# EasyEDA schematic SCH_MKA-Lite-Pi-Interface.json

## Sheets
1 Power and Connectors: TITLE: MKA Lite Power and Connectors; REV: 1.0; Date: 2024-09-11; Sheet: 1/1; Drawn By: A. Franits, T. Salmon; Company: AidF Electronics
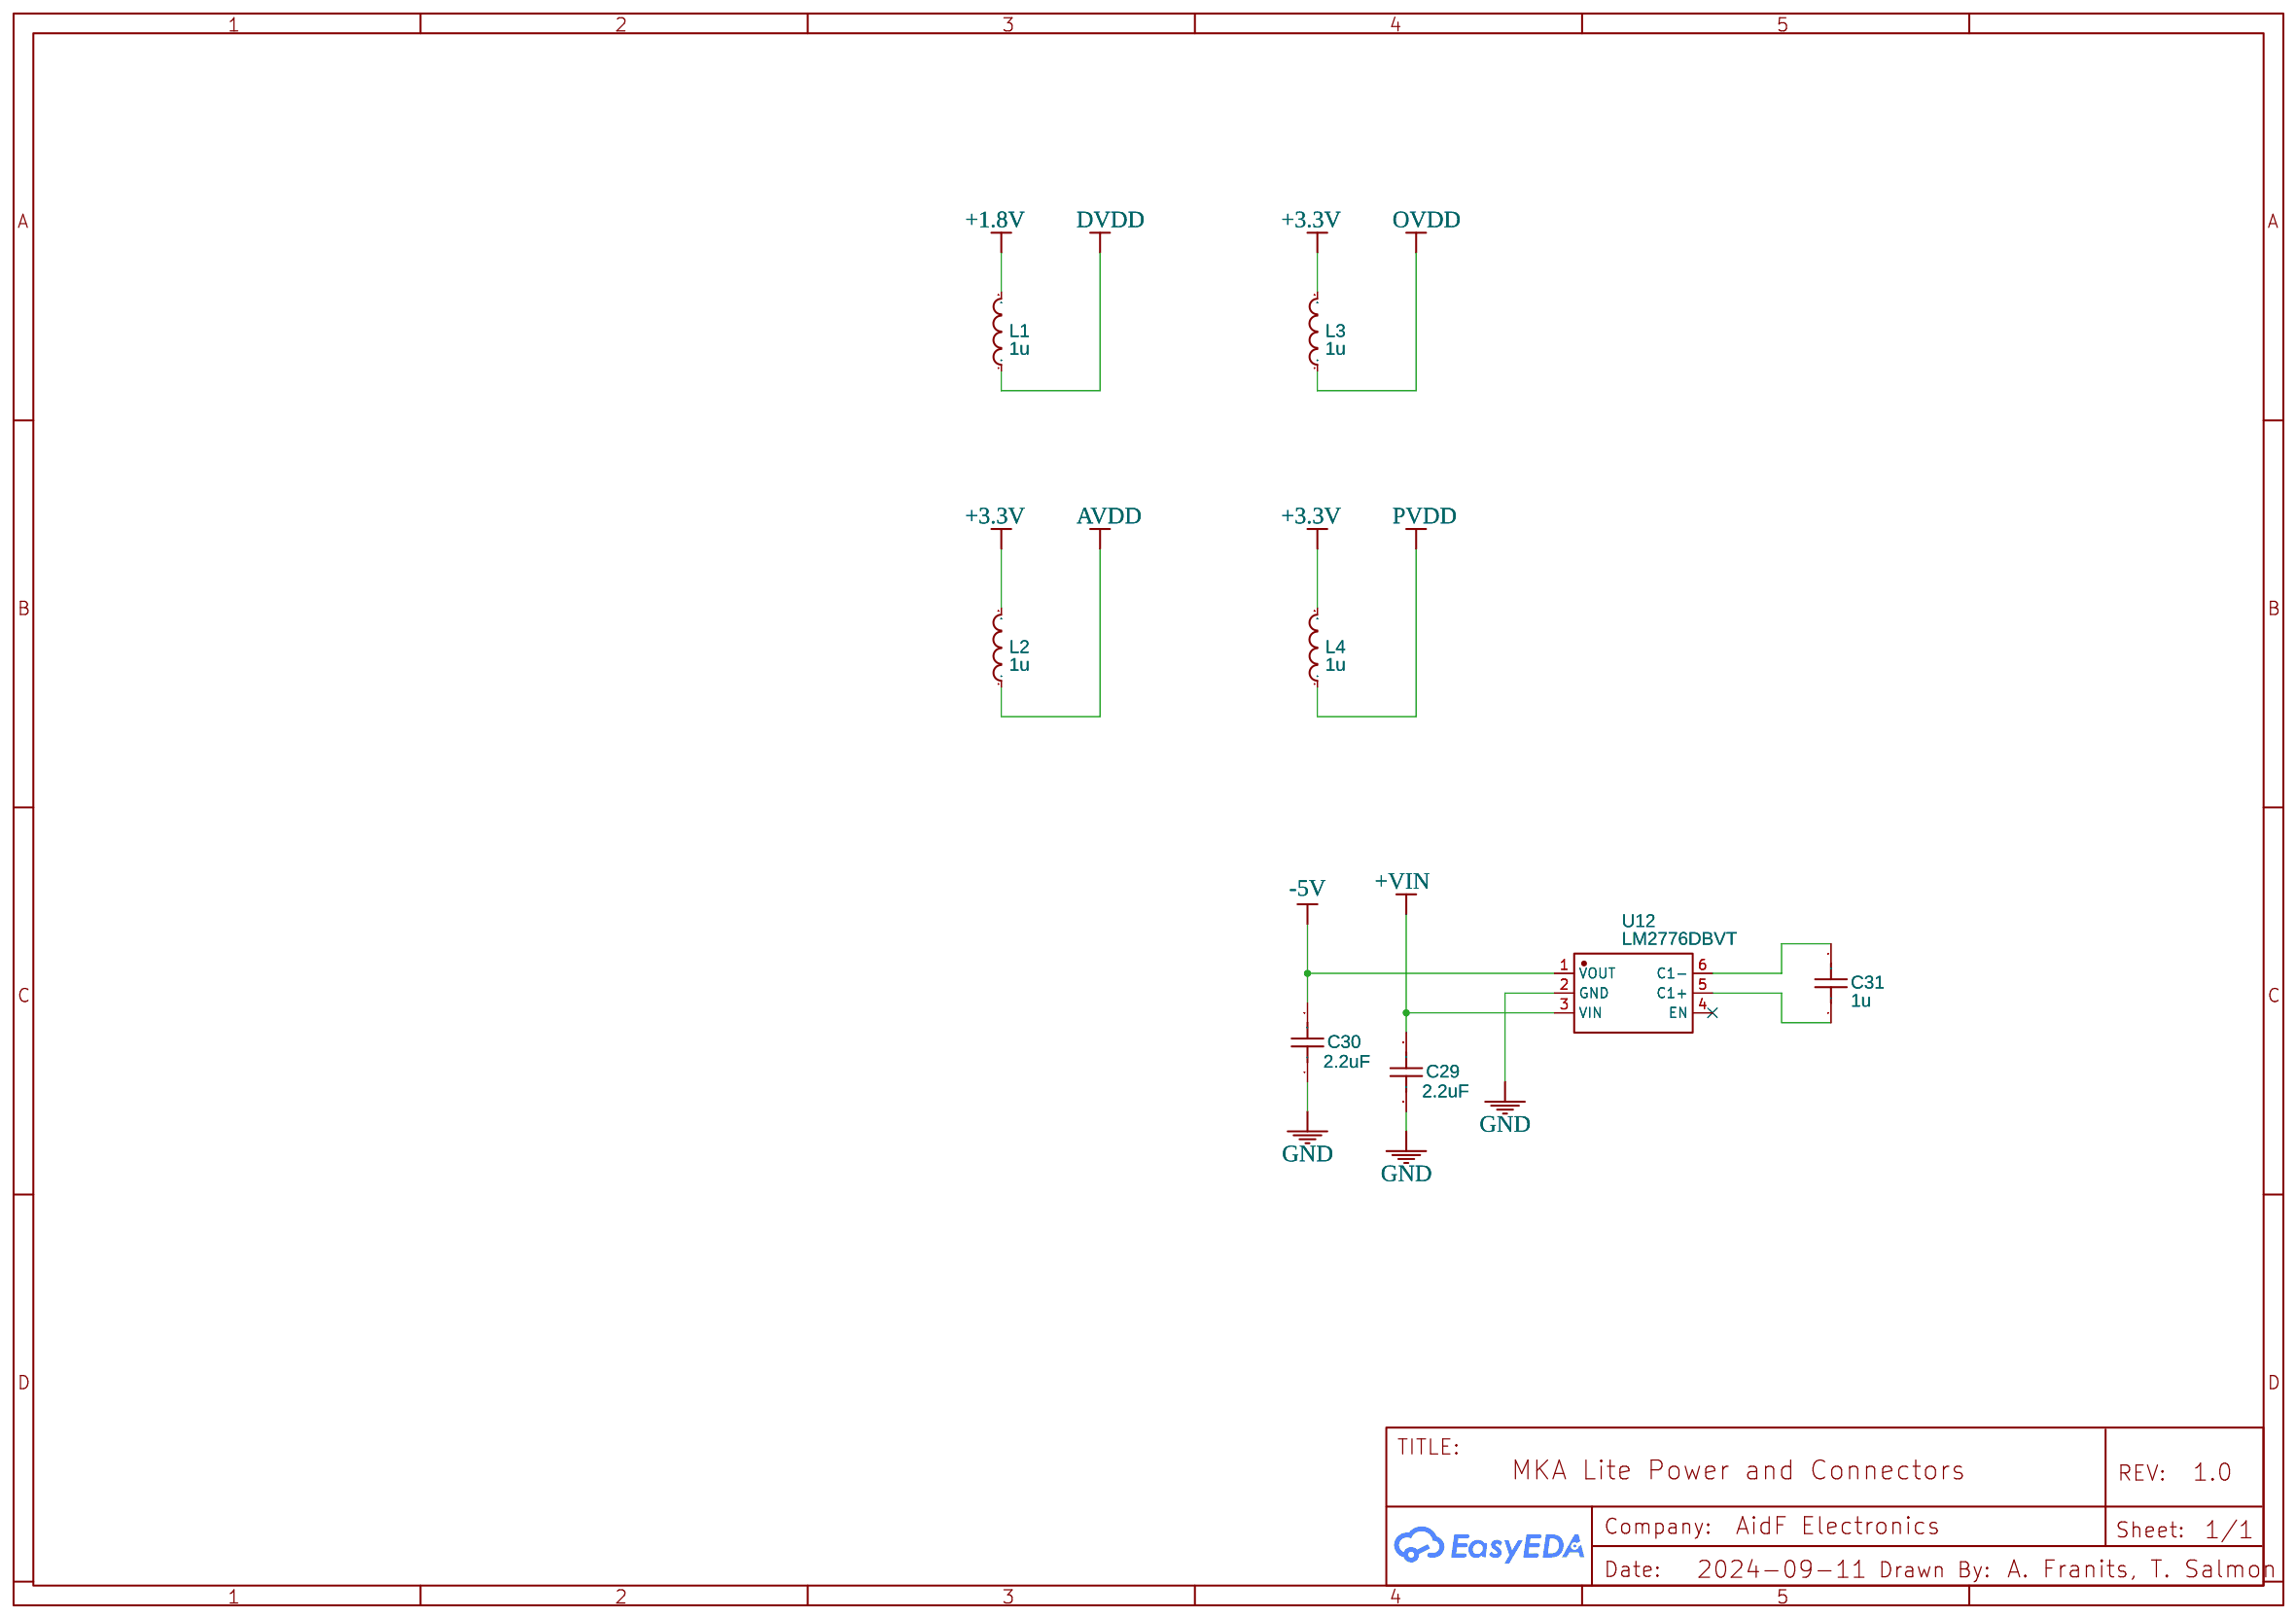
[diagram p0: Power and Connectors]
2 Raspberry Pi CM4 Interface: TITLE: MKA Lite Raspberry Pi Interface
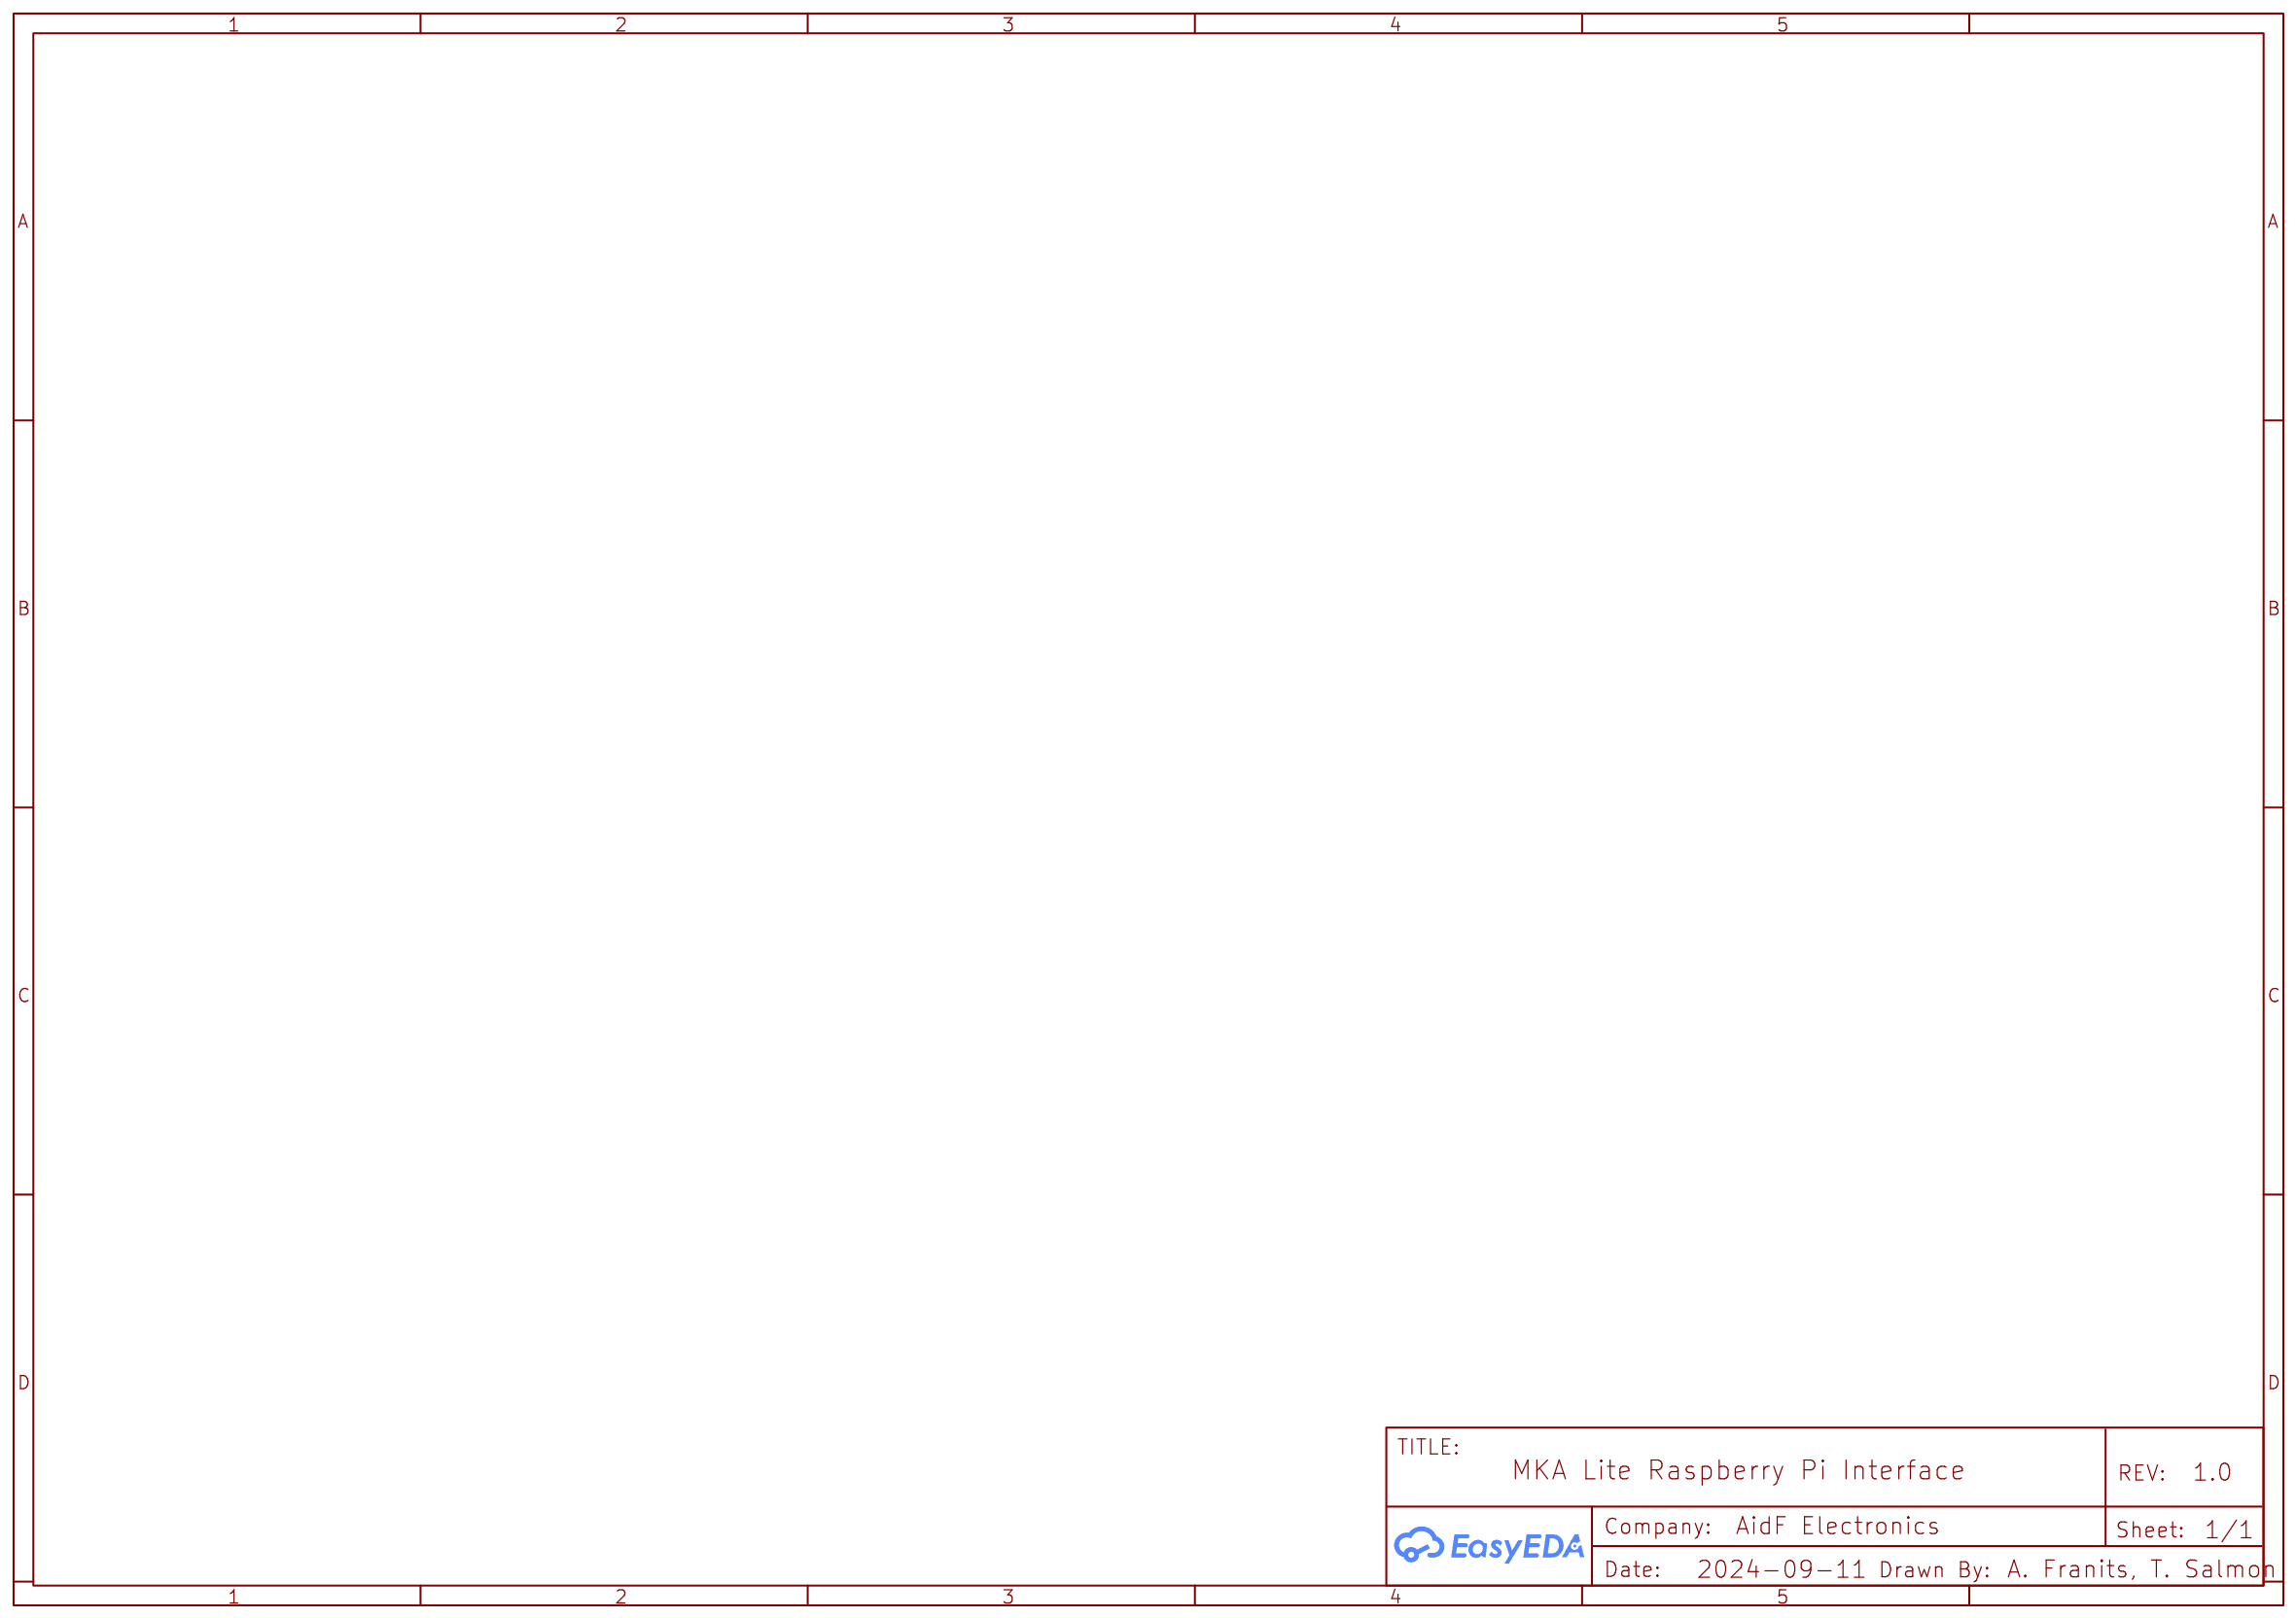
[diagram p1: Raspberry Pi CM4 Interface]
3 HDMI Inlet: TITLE: MKA Lite HDMI Conversion
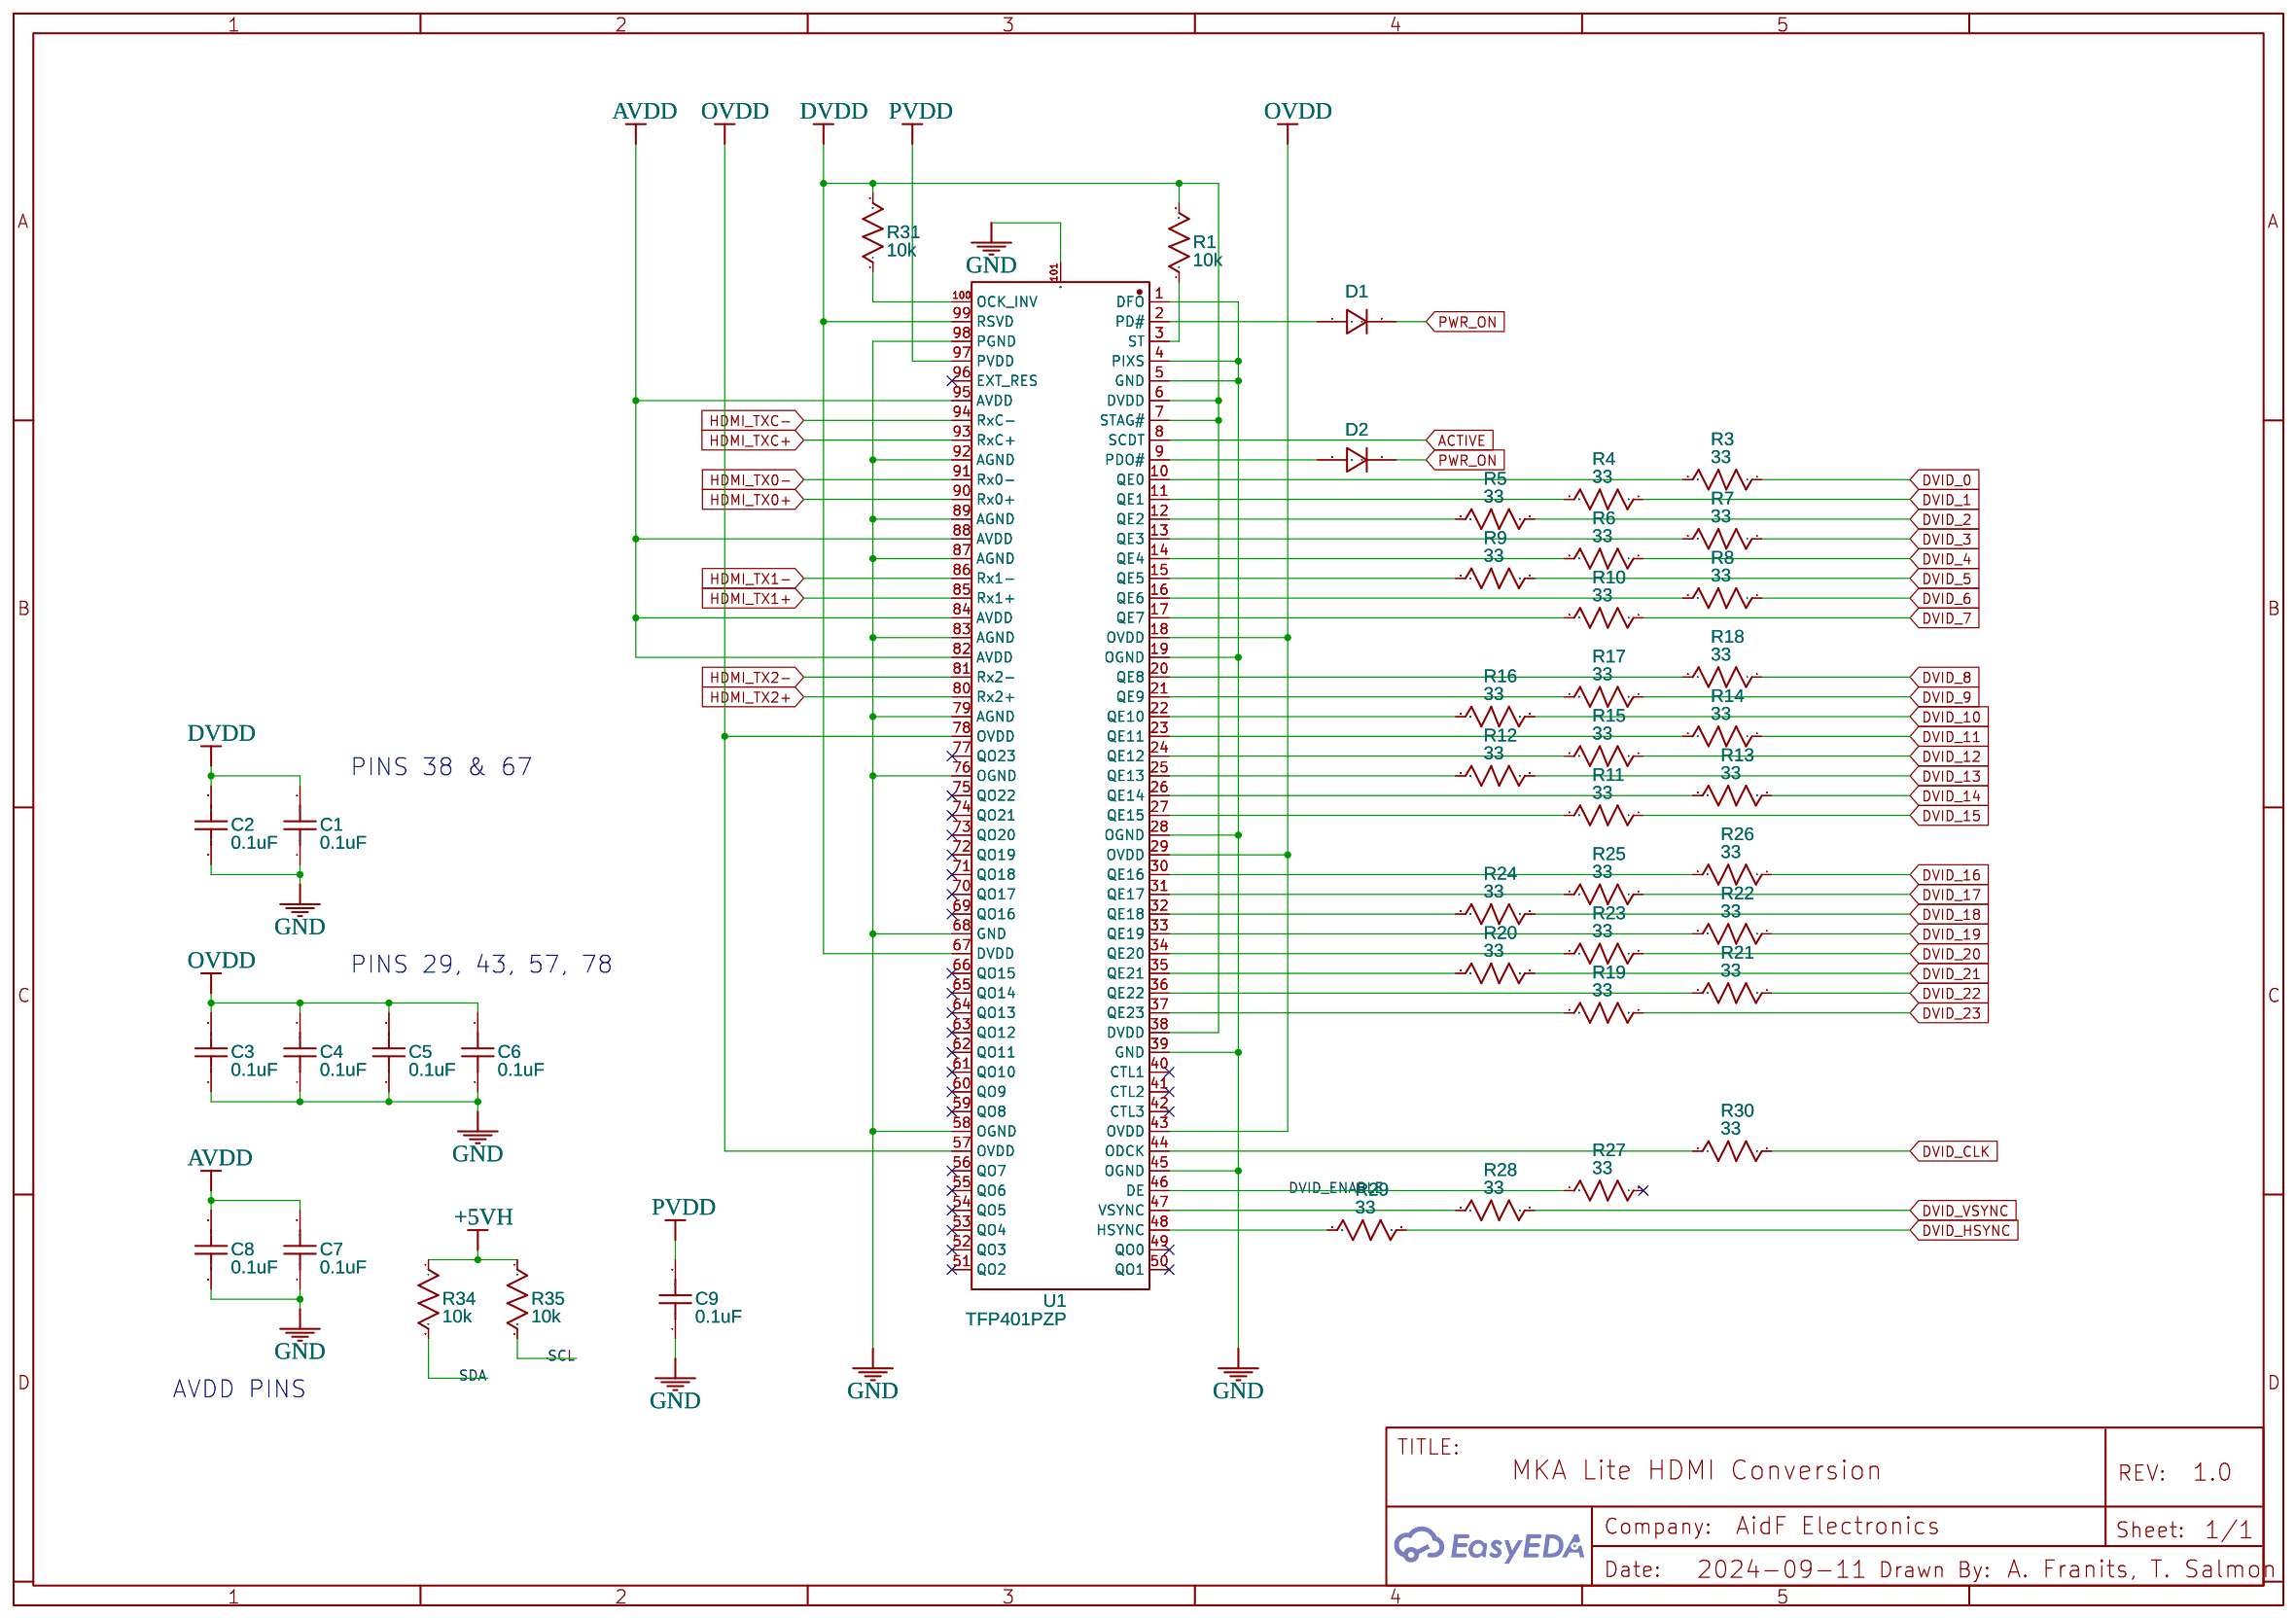
[diagram p2: HDMI Inlet]
4 RGB Outlet: TITLE: MKA Lite RGB Outlet
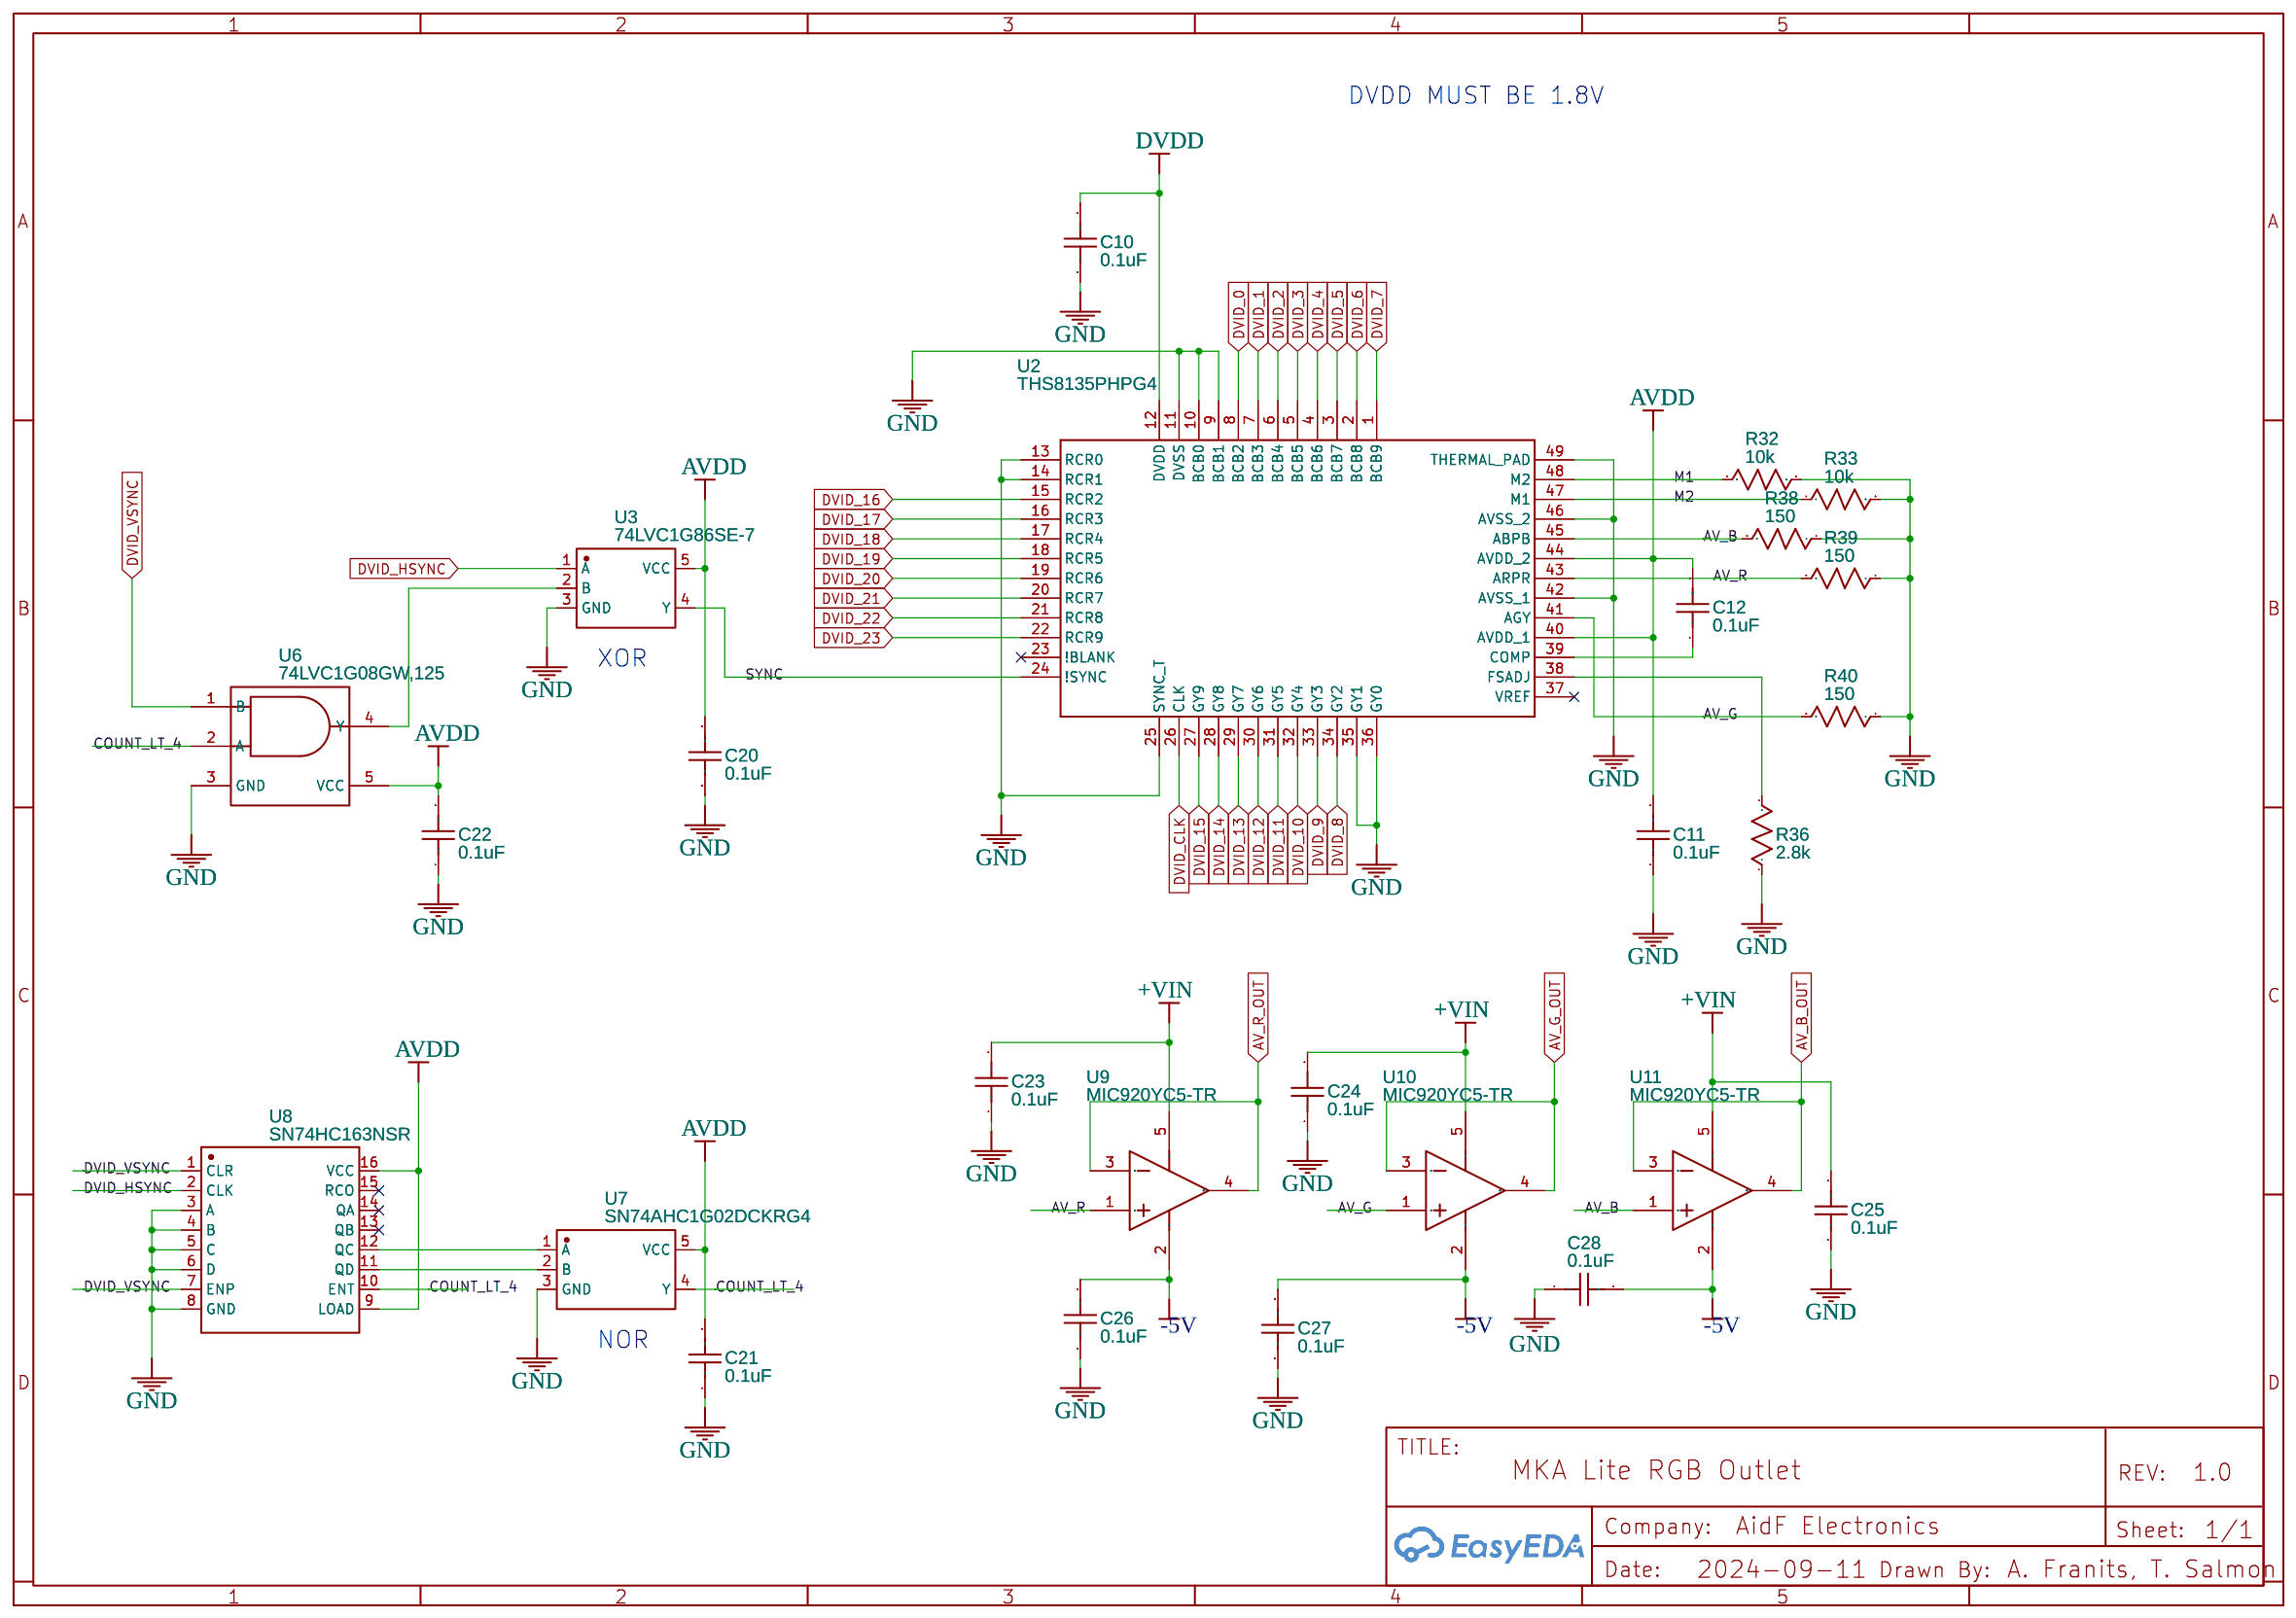
[diagram p3: RGB Outlet]
5 Audio Processing: TITLE: MKA Lite Audio Processing; Drawn By: Ted Salmon
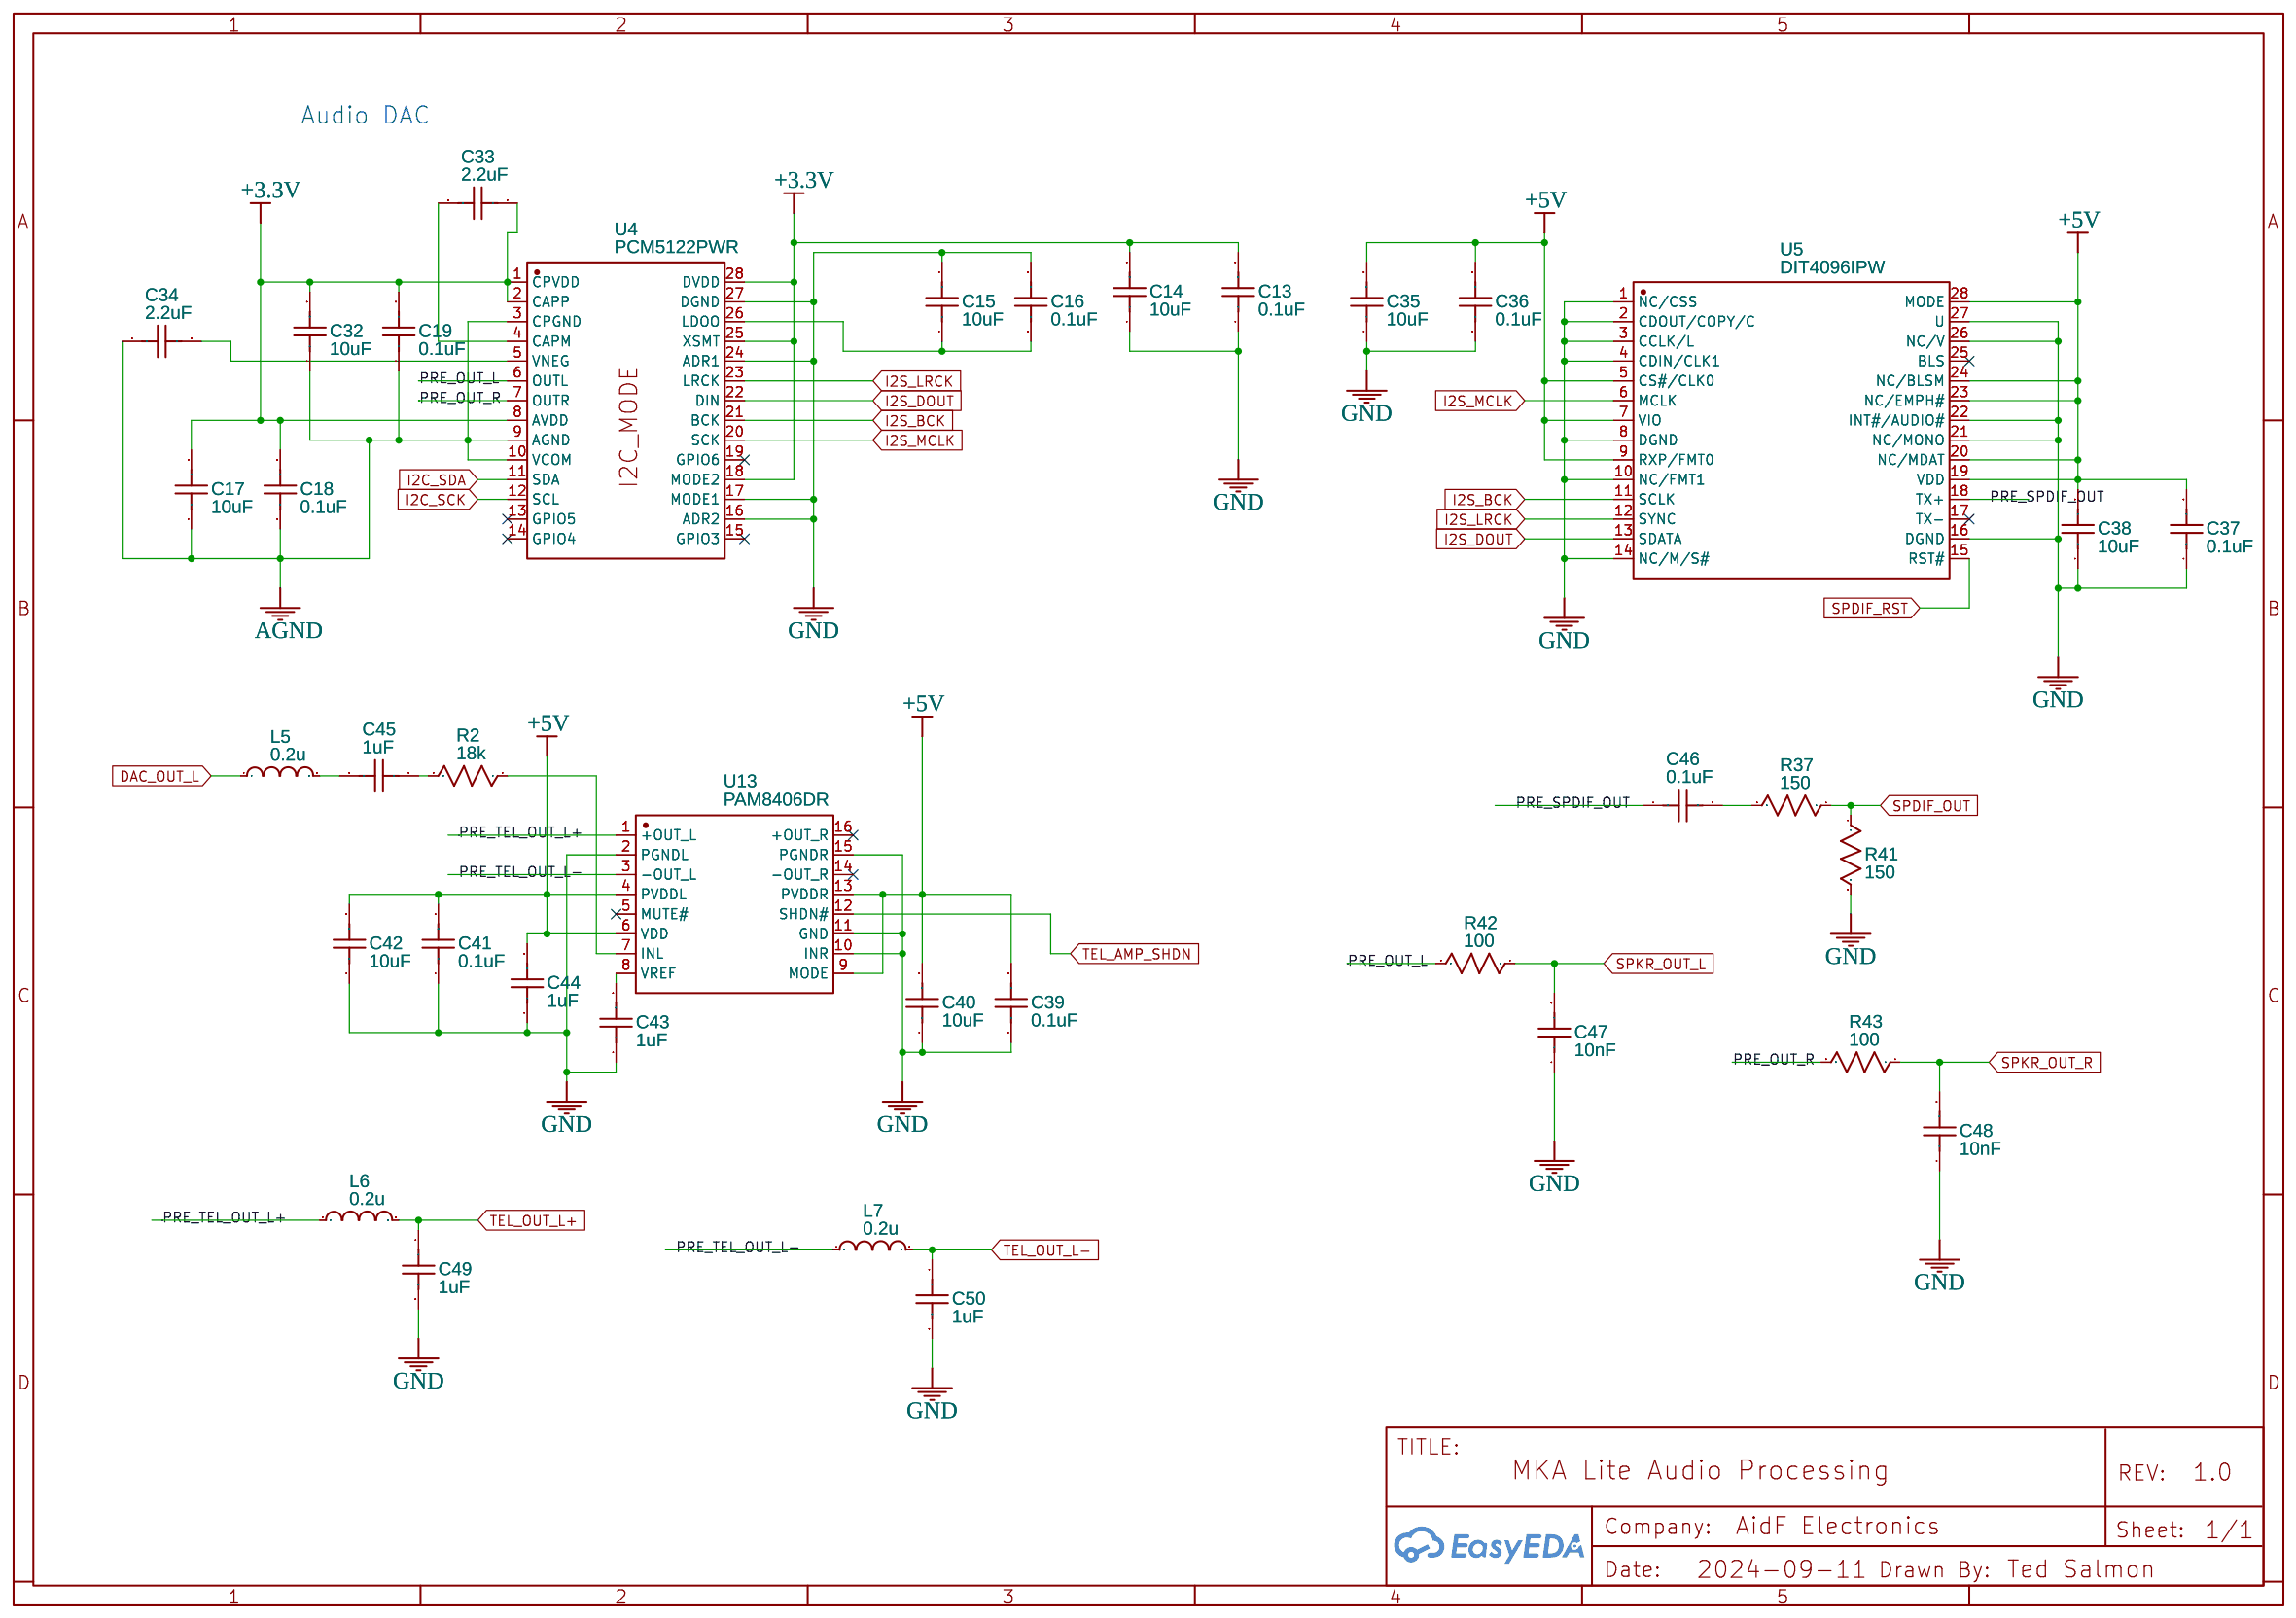
[diagram p4: Audio Processing]

## Parts
sheet Audio Processing
C13  0.1uF  [C0603]
C14  10uF  [C0603]
C15  10uF  [C0603]
C16  0.1uF  [C0603]
C17  10uF  [C0603]
C18  0.1uF  [C0603]
C19  0.1uF  [C0603]
C32  10uF  [C0603]
C33  2.2uF  [C0603]
C34  2.2uF  [C0603]
C35  10uF  [C0603]
C36  0.1uF  [C0603]
C37  0.1uF  [C0603]
C38  10uF  [C0603]
C39  0.1uF  [C0603]
C40  10uF  [C0603]
C41  0.1uF  [C0603]
C42  10uF  [C0603]
C43  1uF  [C0603]
C44  1uF  [C0603]
C45  1uF  [C0603]
C46  0.1uF  [C0603]
C47  10nF  [C0603]
C48  10nF  [C0603]
C49  1uF  [C0603]
C50  1uF  [C0603]
L5  0.2u  [L0603]
L6  0.2u  [L0603]
L7  0.2u  [L0603]
R2  18k  [R0603]
R37  150  [R0603]
R41  150  [R0603]
R42  100  [R0603]
R43  100  [R0603]
U4  PCM5122PWR  [TSSOP-28_L9.8-W6.6-P0.65-BL]
U5  DIT4096IPW  [TSSOP-28_L9.7-W4.4-P0.65-LS6.4-BL]
U13  PAM8406DR  [SOIC-16_L9.9-W3.9-P1.27-LS6.0-BL]
sheet HDMI Inlet
C1  0.1uF  [C0603]
C2  0.1uF  [C0603]
C3  0.1uF  [C0603]
C4  0.1uF  [C0603]
C5  0.1uF  [C0603]
C6  0.1uF  [C0603]
C7  0.1uF  [C0603]
C8  0.1uF  [C0603]
C9  0.1uF  [C0603]
D1  SD103AWS-TP  [SOD-323_L1.8-W1.3-LS2.6-FD]
D2  SD103AWS-TP  [SOD-323_L1.8-W1.3-LS2.6-FD]
R1  10k  [R0603]
R3  33  [R0603]
R4  33  [R0603]
R5  33  [R0603]
R6  33  [R0603]
R7  33  [R0603]
R8  33  [R0603]
R9  33  [R0603]
R10  33  [R0603]
R11  33  [R0603]
R12  33  [R0603]
R13  33  [R0603]
R14  33  [R0603]
R15  33  [R0603]
R16  33  [R0603]
R17  33  [R0603]
R18  33  [R0603]
R19  33  [R0603]
R20  33  [R0603]
R21  33  [R0603]
R22  33  [R0603]
R23  33  [R0603]
R24  33  [R0603]
R25  33  [R0603]
R26  33  [R0603]
R27  33  [R0603]
R28  33  [R0603]
R29  33  [R0603]
R30  33  [R0603]
R31  10k  [R0603]
R34  10k  [R0603]
R35  10k  [R0603]
U1  TFP401PZP  [HTQFP-100_L14.0-W14.0-P0.50-LS16.0-BL-EP5.2]
sheet Power and Connectors
C29  2.2uF  [C0603]
C30  2.2uF  [C0603]
C31  1u  [C0603]
L1  1u  [L0603]
L2  1u  [L0603]
L3  1u  [L0603]
L4  1u  [L0603]
U12  LM2776DBVT  [SOT-23-6_L2.9-W1.6-P0.95-LS2.8-BR]
sheet RGB Outlet
C10  0.1uF  [C0603]
C11  0.1uF  [C0603]
C12  0.1uF  [C0603]
C20  0.1uF  [C0603]
C21  0.1uF  [C0603]
C22  0.1uF  [C0603]
C23  0.1uF  [C0603]
C24  0.1uF  [C0603]
C25  0.1uF  [C0603]
C26  0.1uF  [C0603]
C27  0.1uF  [C0603]
C28  0.1uF  [C0603]
R32  10k  [R0603]
R33  10k  [R0603]
R36  2.8k  [R0603]
R38  150  [R0603]
R39  150  [R0603]
R40  150  [R0603]
U2  THS8135PHPG4  [QFP50P900X900X120-49N]
U3  74LVC1G86SE-7  [SOT-353-5_L2.0-W1.3-P0.65-LS2.1-BR]
U6  74LVC1G08GW,125  [SOT-353_L2.1-W1.3-P0.65-LS2.3-BR]
U7  SN74AHC1G02DCKRG4  [SC-70-5_L2.1-W1.3-P0.65-LS2.1-BR]
U8  SN74HC163NSR  [SO-16_L10.3-W5.3-P1.27-LS7.8-BL]
U9  MIC920YC5-TR  [SC-70-5_L2.1-W1.3-P0.65-LS2.1-TL]
U10  MIC920YC5-TR  [SC-70-5_L2.1-W1.3-P0.65-LS2.1-TL]
U11  MIC920YC5-TR  [SC-70-5_L2.1-W1.3-P0.65-LS2.1-TL]

## Library data of the parts
C1-C13 C16 C18-C28 C36 C37 C39 C41 C46 = C_0603_US: Supplier Part: 1292-1392-1-ND; Supplier: Digi-Key; Contributor: LCEDA_Lib; Manufacturer Part: 0603B104K101CT; Manufacturer: Walsin Technology Corporation
C14 C15 C17 C32 C35 C38 C40 C42 = C_0603_US: Supplier Part: 490-18214-1-ND; Supplier: Digi-Key; Contributor: LCEDA_Lib; Manufacturer Part: GRM188R61E106KA73D; Manufacturer: Murata Electronics
C33 C34 = C_0603_US: Supplier Part: 490-10731-1-ND; Supplier: Digi-Key; Contributor: LCEDA_Lib; Manufacturer Part: GRM188R61E225KA12D; Manufacturer: Murata Electronics
C43-C45 C49 C50 = C_0603_US: Supplier Part: 311-1445-1-ND; Supplier: Digi-Key; Contributor: LCEDA_Lib; Manufacturer Part: CC0603KRX5R8BB105; Manufacturer: YAGEO
C47 C48 = C_0603_US: Supplier Part: 490-4781-1-ND; Supplier: Digi-Key; Contributor: LCEDA_Lib; Manufacturer Part: GCM188R72A103KA37D; Manufacturer: Murata Electronics
L1-L7 = L0603_US: Supplier Part: 490-5227-1-ND; Supplier: Digi-Key; Contributor: LCEDA_Lib; Manufacturer Part: BLM18RK601SN1D; Manufacturer: Murata Electronics
R2 = R_0603_US: Supplier Part: 311-18.0KHRCT-ND; Supplier: Digi-Key; Contributor: LCEDA_Lib; Manufacturer Part: RC0603FR-0718KL; Manufacturer: YAGEO
R37 R41 = R_0603_US: Supplier Part: 311-150GRCT-ND; Supplier: Digi-Key; Contributor: LCEDA_Lib; Manufacturer Part: RC0603JR-07150RL; Manufacturer: YAGEO
R42 R43 = R_0603_US: Supplier Part: 311-100HRCT-ND; Supplier: Digi-Key; Contributor: LCEDA_Lib; Manufacturer Part: RC0603FR-07100RL; Manufacturer: YAGEO
U4 = PCM5122PWR: Contributor: LCSC; Supplier: Digi-Key; Supplier Part: 296-35527-1-ND; Manufacturer: Texas Instruments; JLCPCB Part Class: Extended Part
U5 = DIT4096IPW: Contributor: lcsc; Supplier: LCSC; Supplier Part: C2863646; Manufacturer: TI(德州仪器); JLCPCB Part Class: Extended Part
U13 = PAM8406DR: Contributor: LCSC; Supplier: Digi-Key; Manufacturer: Diodes Incorporated; Supplier Part: PAM8406DRDICT-ND; JLCPCB Part Class: Extended Part
D1 D2 = 1N4148: Supplier: Digi-Key; Supplier Part: SD103AWSTPMSCT-ND; Manufacturer: Micro Commercial Co; Contributor: LCSC
R1 R31-R35 = R_0603_US: Supplier Part: RHM10KDCT-ND; Supplier: Digi-Key; Contributor: LCEDA_Lib; Manufacturer Part: ESR03EZPJ103; Manufacturer: Rohm Semiconductor
R3-R30 = R_0603_US: Supplier Part: 1292-WR06X330JTLCT-ND; Supplier: Digi-Key; Contributor: LCEDA_Lib; Manufacturer Part: WR06X330 JTL; Manufacturer: Walsin Technology Corporation
U1 = TFP401PZP: Contributor: LCSC; Supplier: Digi-Key; Supplier Part: 296-9992-ND; Manufacturer: Texas Instruments; JLCPCB Part Class: Extended Part; link: https://lcsc.com/eda_search?q=C2867606&%26type=1&ref=editor
C29 C30 = C_0603_US: Supplier Part: 445-5964-1-ND; Supplier: Digi-Key; Contributor: LCEDA_Lib; Manufacturer Part: C1608X5R1E225K080AB; Manufacturer: TDK Corporation
C31 = C_0603_US: Supplier Part: 1276-1860-1-ND; Supplier: Digi-Key; Contributor: LCEDA_Lib; Manufacturer Part: CL10A105KB8NNNC; Manufacturer: Samsung Electro-Mechanics
U12 = LM2776DBVT: Contributor: lcsc; Supplier: LCSC; Supplier Part: C840110; Manufacturer: TI(德州仪器); JLCPCB Part Class: Extended Part
R36 = R_0603_US: Supplier Part: RMCF0603FT2K80CT-ND; Supplier: Digi-Key; Contributor: LCEDA_Lib; Manufacturer Part: RMCF0603FT2K80; Manufacturer: Stackpole Electronics Inc
R38-R40 = R_0603_US: Supplier Part: 311-150HRCT-ND; Supplier: Digi-Key; Contributor: LCEDA_Lib; Manufacturer Part: RC0603FR-07150RL; Manufacturer: YAGEO
U2 = THS8135PHPG4: Contributor: Marlon Vinicius; Manufacturer Part: THS8135PHP; Supplier: Digi-Key; Supplier Part: 296-13049-5-ND; Manufacturer: Texas Instruments
U3 = 74LVC1G86SE-7: Contributor: LCSC; Supplier: Digi-Key; Supplier Part: 74LVC1G86SE-7DICT-ND; Manufacturer: Diodes Incorporated; JLCPCB Part Class: Extended Part
U6 = 74LVC1G08GW,125: Supplier: Digi-Key; Manufacturer: Nexperia USA Inc.; Supplier Part: 1727-2872-1-ND; JLCPCB Part Class: Extended Part
U7 = SN74AHC1G02DCKRG4: Contributor: LCSC; Supplier: LCSC; Supplier Part: C2865650; Manufacturer: TI(德州仪器)
U8 = SN74HC163NSR: Contributor: LCSC; Supplier: Digi-Key; Supplier Part: 296-12889-1-ND; Manufacturer: Texas Instruments
U9-U11 = MIC920YC5-TR: Contributor: LCSC; Supplier: Digi-Key; Manufacturer: Microchip Technology; Supplier Part: 576-4560-1-ND; JLCPCB Part Class: Extended Part

## Nets
+1.8V: L1.2
+3.3V: C13.2 C14.2 C17.2 C18.2 C19.2 C32.2 C33.1 L2.2 L3.2 L4.2 U4.1(CPVDD) U4.2(CAPP) U4.8(AVDD) U4.18(MODE2) U4.25(XSMT) U4.28(DVDD)
+5V: C35.2 C36.2 C37.2 C38.2 C39.2 C40.2 C41.2 C42.2 C44.2 U5.5(CS#/CLK0) U5.7(VIO) U5.9(RXP/FMT0) U5.19(VDD) U5.20(NC/MDAT) U5.23(NC/EMPH#) U5.24(NC/BLSM) U5.28(MODE) U13.4(PVDDL) U13.6(VDD) U13.9(MODE) U13.13(PVDDR)
+5VH: R34.1 R35.1
+VIN: C23.2 C24.2 C25.2 C29.2 U9.5(VDD) U10.5(VDD) U11.5(VDD) U12.3(VIN)
-5V: C26.2 C27.2 C28.2 C30.2 U9.2(VSS) U10.2(VSS) U11.2(VSS) U12.1(VOUT)
AGND: C17.1 C18.1 C19.1 C32.1 C34.1 U4.3(CPGND) U4.9(AGND) U4.10(VCOM)
AVDD: C7.2 C8.2 C11.2 C12.2 C20.2 C21.2 C22.2 L2.1 U1.82(AVDD) U1.84(AVDD) U1.88(AVDD) U1.95(AVDD) U2.40(AVDD_1) U2.44(AVDD_2) U3.5(VCC) U6.5(VCC) U7.5(VCC) U8.9(LOAD) U8.16(VCC)
DVDD: C1.2 C2.2 C10.2 L1.1 R1.2 R31.2 U1.6(DVDD) U1.7(STAG#) U1.38(DVDD) U1.67(DVDD) U1.99(RSVD) U2.12(DVDD)
GND: C1.1 C2.1 C3.1 C4.1 C5.1 C6.1 C7.1 C8.1 C9.1 C10.1 C11.1 C13.1 C14.1 C15.2 C16.2 C20.1 C21.1 C22.1 C23.1 C24.1 C25.1 C26.1 C27.1 C28.1 C29.1 C30.1 C35.1 C36.1 C37.1 C38.1 C39.1 C40.1 C41.1 C42.1 C43.1 C44.1 C47.1 C48.1 C49.2 C50.2 R32.2 R33.2 R36.1 R38.1 R39.1 R40.1 R41.2 U1.1(DFO) U1.4(PIXS) U1.5(GND) U1.19(OGND) U1.28(OGND) U1.39(GND) U1.45(OGND) U1.58(OGND) U1.68(GND) U1.76(OGND) U1.79(AGND) U1.83(AGND) U1.87(AGND) U1.89(AGND) U1.92(AGND) U1.98(PGND) U1.101(PAD) U2.9(BCB1) U2.10(BCB0) U2.11(DVSS) U2.13(RCR0) U2.14(RCR1) U2.25(SYNC_T) U2.35(GY1) U2.36(GY0) U2.42(AVSS_1) U2.46(AVSS_2) U2.49(THERMAL_PAD) U3.3(GND) U4.16(ADR2) U4.17(MODE1) U4.24(ADR1) U4.27(DGND) U5.1(NC/CSS) U5.2(CDOUT/COPY/C) U5.3(CCLK/L) U5.4(CDIN/CLK1) U5.8(DGND) U5.10(NC/FMT1) U5.14(NC/M/S#) U5.16(DGND) U5.21(NC/MONO) U5.22(INT#/AUDIO#) U5.26(NC/V) U5.27(U) U6.3(GND) U7.3(GND) U8.3(A) U8.4(B) U8.5(C) U8.6(D) U8.8(GND) U12.2(GND) U13.2(PGNDL) U13.10(INR) U13.11(GND) U13.15(PGNDR)
PVDD: C9.2 L4.1 U1.97(PVDD)
ACTIVE: U1.8(SCDT)
AV_B: R38.2 U2.45(ABPB) U11.1(VIN+)
AV_B_OUT: U11.3(VIN-) U11.4(VOUT)
AV_G: R40.2 U2.41(AGY) U10.1(VIN+)
AV_G_OUT: U10.3(VIN-) U10.4(VOUT)
AV_R: R39.2 U2.43(ARPR) U9.1(VIN+)
AV_R_OUT: U9.3(VIN-) U9.4(VOUT)
COUNT_LT_4: U6.2(A) U7.4(Y) U8.10(ENT)
DAC_OUT_L: L5.1
DVID_0: R3.1 U2.8(BCB2)
DVID_1: R4.1 U2.7(BCB3)
DVID_2: R5.1 U2.6(BCB4)
DVID_3: R7.1 U2.5(BCB5)
DVID_4: R6.1 U2.4(BCB6)
DVID_5: R9.1 U2.3(BCB7)
DVID_6: R8.1 U2.2(BCB8)
DVID_7: R10.1 U2.1(BCB9)
DVID_8: R18.1 U2.34(GY2)
DVID_9: R17.1 U2.33(GY3)
DVID_10: R16.1 U2.32(GY4)
DVID_11: R14.1 U2.31(GY5)
DVID_12: R15.1 U2.30(GY6)
DVID_13: R12.1 U2.29(GY7)
DVID_14: R13.1 U2.28(GY8)
DVID_15: R11.1 U2.27(GY9)
DVID_16: R26.1 U2.15(RCR2)
DVID_17: R25.1 U2.16(RCR3)
DVID_18: R24.1 U2.17(RCR4)
DVID_19: R22.1 U2.18(RCR5)
DVID_20: R23.1 U2.19(RCR6)
DVID_21: R20.1 U2.20(RCR7)
DVID_22: R21.1 U2.21(RCR8)
DVID_23: R19.1 U2.22(RCR9)
DVID_CLK: R30.1 U2.26(CLK)
DVID_ENABLE: R27.2 U1.46(DE)
DVID_HSYNC: R29.1 U3.1(A) U8.2(CLK)
DVID_VSYNC: R28.1 U6.1(B) U8.1(CLR) U8.7(ENP)
HDMI_TX0+: U1.90(Rx0+)
HDMI_TX0-: U1.91(Rx0-)
HDMI_TX1+: U1.85(Rx1+)
HDMI_TX1-: U1.86(Rx1-)
HDMI_TX2+: U1.80(Rx2+)
HDMI_TX2-: U1.81(Rx2-)
HDMI_TXC+: U1.93(RxC+)
HDMI_TXC-: U1.94(RxC-)
I2C_SCK: U4.12(SCL)
I2C_SDA: U4.11(SDA)
I2S_BCK: U4.21(BCK) U5.11(SCLK)
I2S_DOUT: U4.22(DIN) U5.13(SDATA)
I2S_LRCK: U4.23(LRCK) U5.12(SYNC)
I2S_MCLK: U4.20(SCK) U5.6(MCLK)
M1: R32.1 U2.48(M2)
M2: R33.1 U2.47(M1)
OVDD: C3.2 C4.2 C5.2 C6.2 L3.1 U1.18(OVDD) U1.29(OVDD) U1.43(OVDD) U1.57(OVDD) U1.78(OVDD)
PRE_OUT_L: R42.2 U4.6(OUTL)
PRE_OUT_R: R43.2 U4.7(OUTR)
PRE_SPDIF_OUT: C46.1 U5.18(TX+)
PRE_TEL_OUT_L+: L6.1 U13.1(+OUT_L)
PRE_TEL_OUT_L-: L7.1 U13.3(-OUT_L)
PWR_ON: D1.2 D2.2
SCL: R35.2
SDA: R34.2
SPDIF_OUT: R37.1 R41.1
SPDIF_RST: U5.15(RST#)
SPKR_OUT_L: C47.2 R42.1
SPKR_OUT_R: C48.2 R43.1
SYNC: U2.24(!SYNC) U3.4(Y)
TEL_AMP_SHDN: U13.12(SHDN#)
TEL_OUT_L+: C49.1 L6.2
TEL_OUT_L-: C50.1 L7.2
Net-(C12-1): C12.1 U2.39(COMP)
Net-(C15-1): C15.1 C16.1 U4.26(LDOO)
Net-(C31-1): C31.1 U12.5(C1+)
Net-(C31-2): C31.2 U12.6(C1-)
Net-(C33-2): C33.2 U4.4(CAPM)
Net-(C34-2): C34.2 U4.5(VNEG)
Net-(C43-2): C43.2 U13.8(VREF)
Net-(C45-1): C45.1 R2.2
Net-(C45-2): C45.2 L5.2
Net-(C46-2): C46.2 R37.2
Net-(D1-1): D1.1 U1.2(PD#)
Net-(D2-1): D2.1 U1.9(PDO#)
Net-(R1-1): R1.1 U1.3(ST)
Net-(R2-1): R2.1 U13.7(INL)
Net-(R3-2): R3.2 U1.10(QE0)
Net-(R4-2): R4.2 U1.11(QE1)
Net-(R5-2): R5.2 U1.12(QE2)
Net-(R6-2): R6.2 U1.14(QE4)
Net-(R7-2): R7.2 U1.13(QE3)
Net-(R8-2): R8.2 U1.16(QE6)
Net-(R9-2): R9.2 U1.15(QE5)
Net-(R10-2): R10.2 U1.17(QE7)
Net-(R11-2): R11.2 U1.27(QE15)
Net-(R12-2): R12.2 U1.25(QE13)
Net-(R13-2): R13.2 U1.26(QE14)
Net-(R14-2): R14.2 U1.23(QE11)
Net-(R15-2): R15.2 U1.24(QE12)
Net-(R16-2): R16.2 U1.22(QE10)
Net-(R17-2): R17.2 U1.21(QE9)
Net-(R18-2): R18.2 U1.20(QE8)
Net-(R19-2): R19.2 U1.37(QE23)
Net-(R20-2): R20.2 U1.35(QE21)
Net-(R21-2): R21.2 U1.36(QE22)
Net-(R22-2): R22.2 U1.33(QE19)
Net-(R23-2): R23.2 U1.34(QE20)
Net-(R24-2): R24.2 U1.32(QE18)
Net-(R25-2): R25.2 U1.31(QE17)
Net-(R26-2): R26.2 U1.30(QE16)
Net-(R28-2): R28.2 U1.47(VSYNC)
Net-(R29-2): R29.2 U1.48(HSYNC)
Net-(R30-2): R30.2 U1.44(ODCK)
Net-(R31-1): R31.1 U1.100(OCK_INV)
Net-(R36-2): R36.2 U2.38(FSADJ)
Net-(U3-2): U3.2(B) U6.4(Y)
Net-(U7-1): U7.1(A) U8.12(QC)
Net-(U7-2): U7.2(B) U8.11(QD)

Not connected (* = marked no-connect by the designer): R27 1*; U1 40(CTL1)* 41(CTL2)* 42(CTL3)* 49(QO0)* 50(QO1)* 51(QO2)* 52(QO3)* 53(QO4)* 54(QO5)* 55(QO6)* 56(QO7)* 59(QO8)* 60(QO9)* 61(QO10)* 62(QO11)* 63(QO12)* 64(QO13)* 65(QO14)* 66(QO15)* 69(QO16)* 70(QO17)* 71(QO18)* 72(QO19)* 73(QO20)* 74(QO21)* 75(QO22)* 77(QO23)* 96(EXT_RES)*; U2 23(!BLANK)* 37(VREF)*; U4 13(GPIO5)* 14(GPIO4)* 15(GPIO3)* 19(GPIO6)*; U5 17(TX-)* 25(BLS)*; U8 13(QB)* 14(QA)* 15(RCO)*; U12 4(EN)*; U13 5(MUTE#)* 14(-OUT_R)* 16(+OUT_R)*

## Notes on the sheets
sheet 3
- PINS 38 & 67
- PINS 29, 43, 57, 78
- AVDD PINS
sheet 4
- DVDD MUST BE 1.8V
- XOR
- NOR
sheet 5
- Audio DAC
